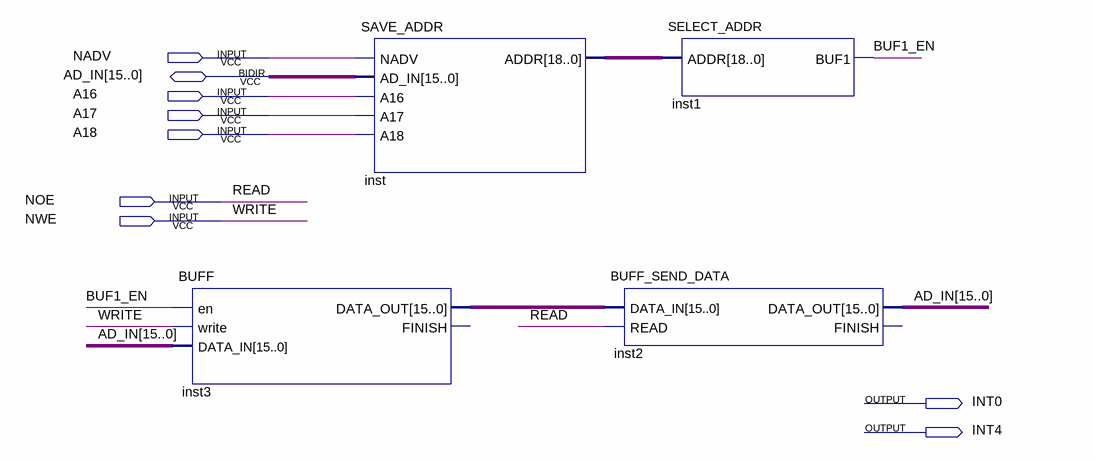
[diagram p0: schematic sheet]
// Quartus schematic FPGA_EP2C.bdf as structural Verilog: 4 symbols, 9 pins
module FPGA_EP2C (
  input  NADV,
  input  A16,
  input  A17,
  input  A18,
  input  NOE,
  input  NWE,
  inout  [15:0] AD_IN,
  output INT0,
  output INT4
);

  wire BUF1_EN;
  wire [15:0] inst3_data_out;
  wire [18:0] inst_addr;

  BUFF inst3 (.en(BUF1_EN), .write(NWE), .DATA_IN(AD_IN), .DATA_OUT(inst3_data_out));  // open: FINISH
  SAVE_ADDR inst (.NADV(NADV), .AD_IN(AD_IN), .A16(A16), .A17(A17), .A18(A18), .ADDR(inst_addr));
  BUFF_SEND_DATA inst2 (.DATA_IN(inst3_data_out), .READ(NOE), .DATA_OUT(AD_IN));  // open: FINISH
  SELECT_ADDR inst1 (.ADDR(inst_addr), .BUF1(BUF1_EN));

  // Other names for the same wires on the sheet: READ = NOE; WRITE = NWE
endmodule
